# Altium schematic sheet Sheet1.SchDoc
size A2
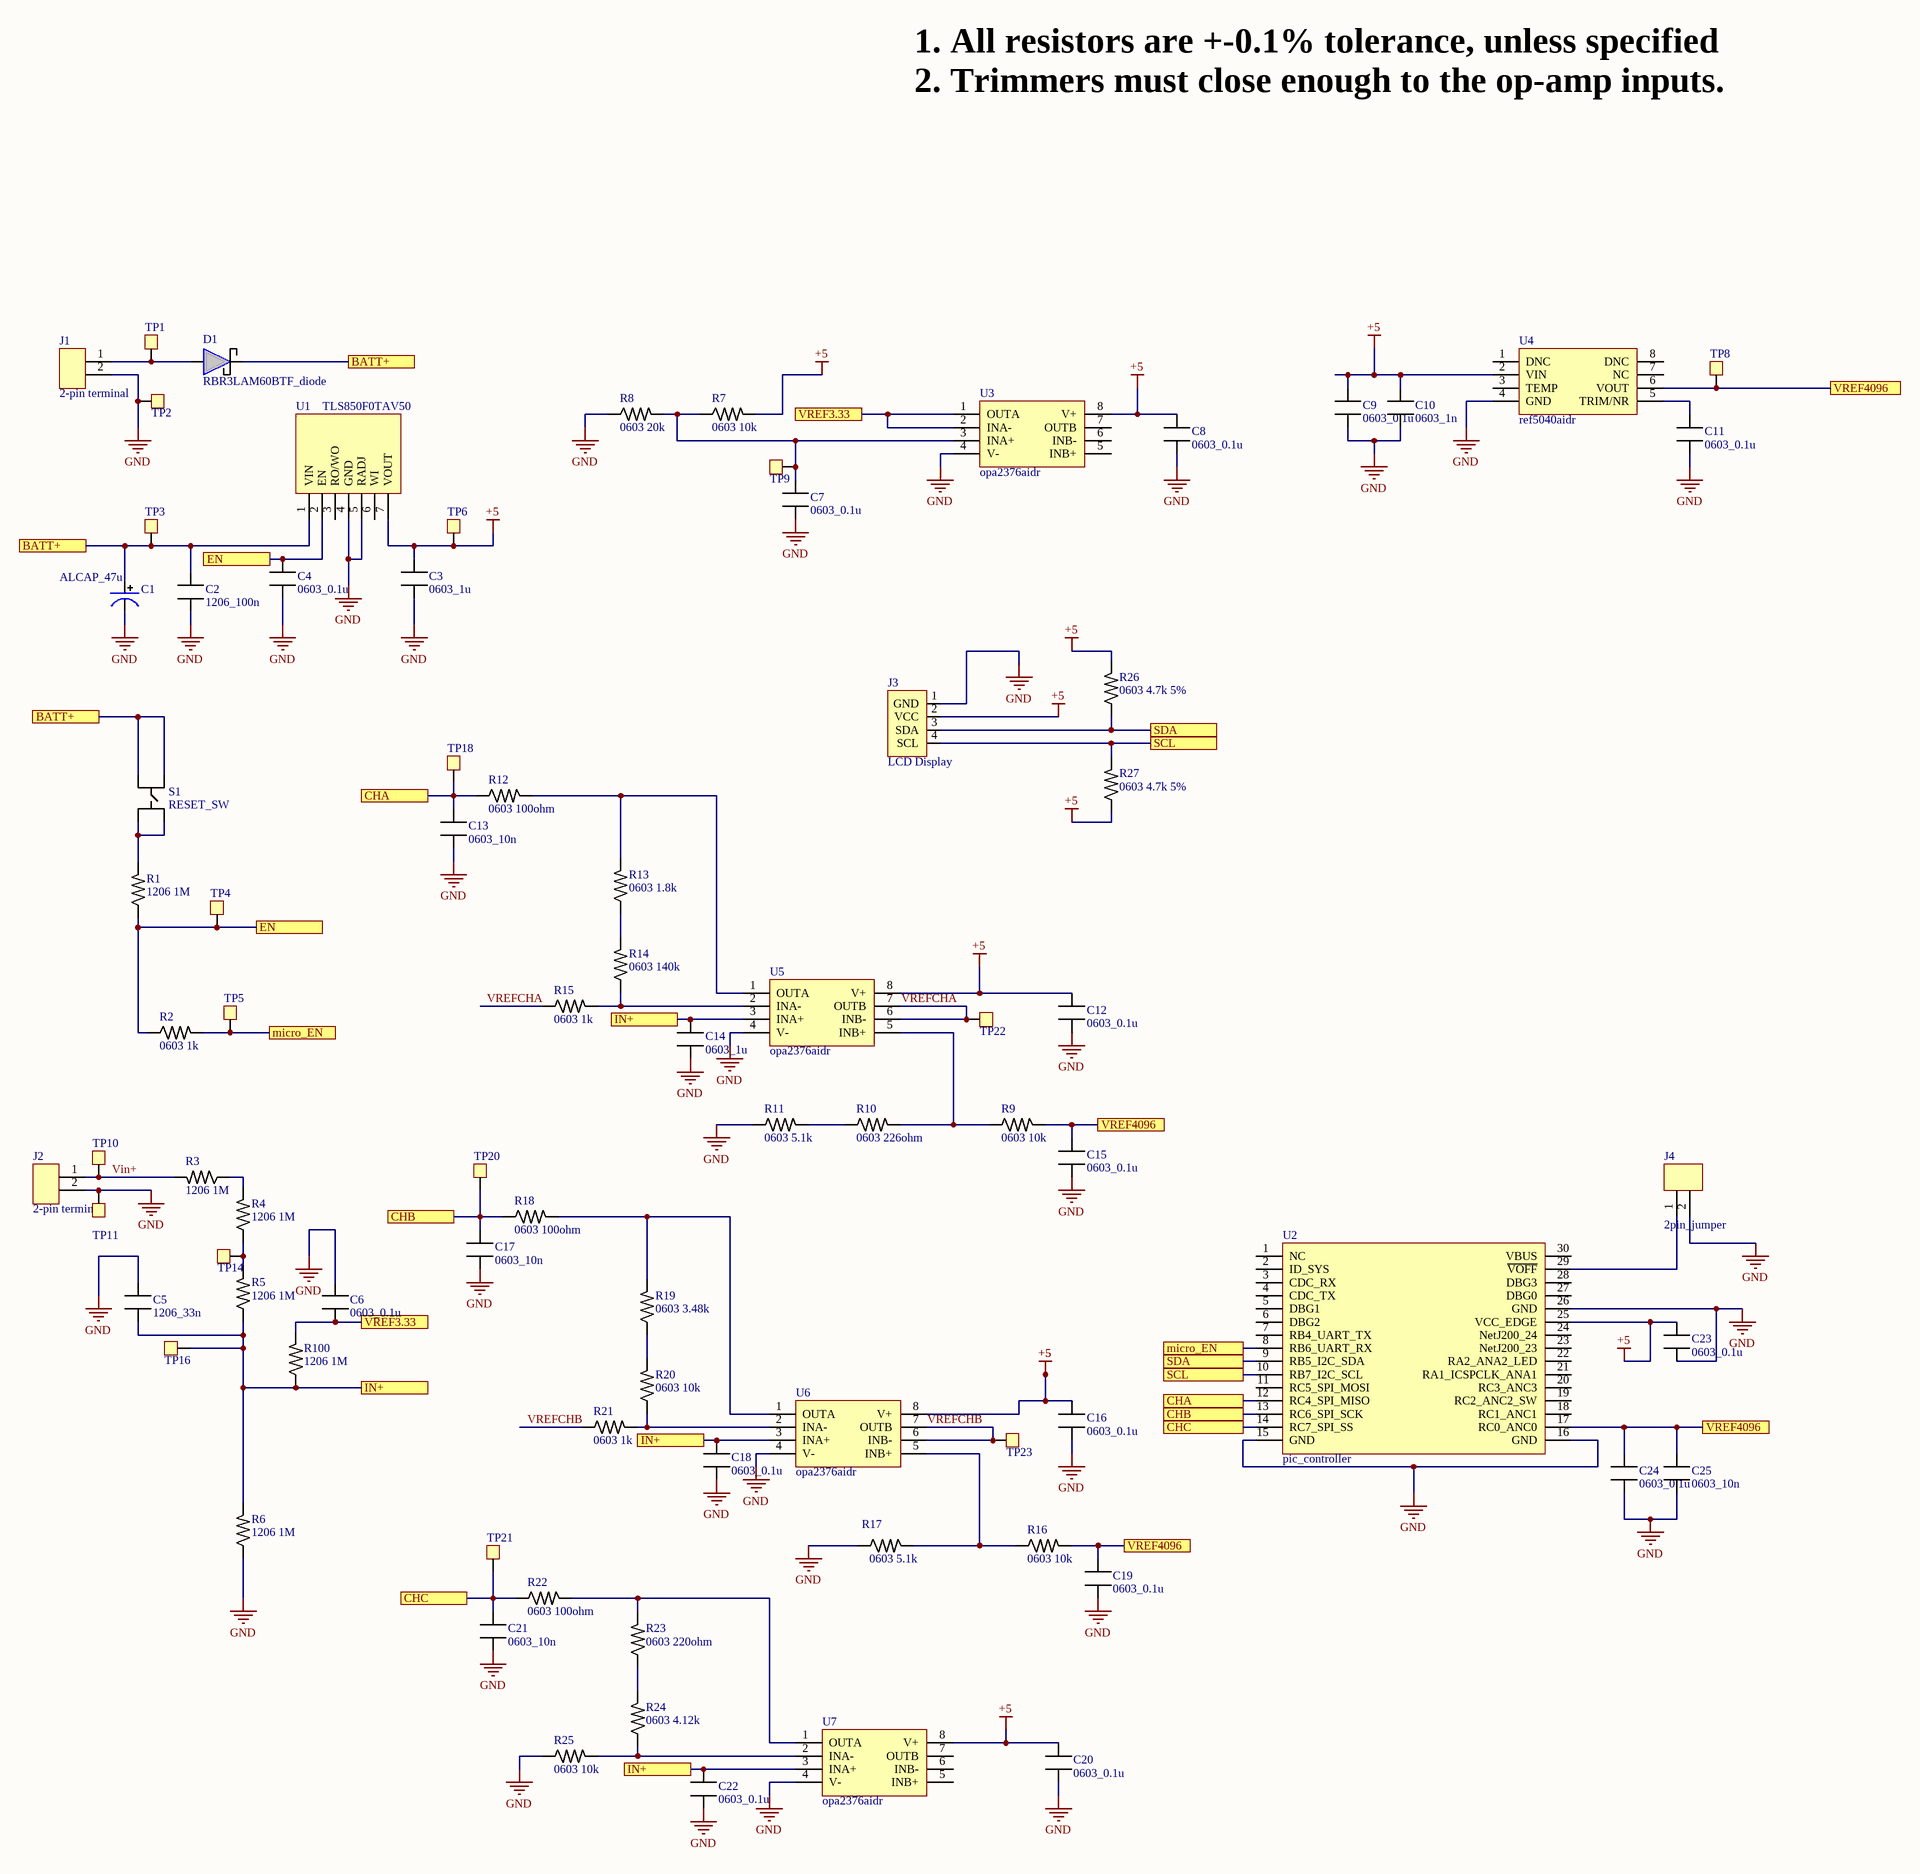
[diagram p0: Sheet1.SchDoc]

## Parts
C1  ALCAP_47u  [47u_cap]
C2  1206_100n  [CAPC3216X10M]
C3  0603_1u  [CAP_0603]
C4  0603_0.1u  [CAP_0603]
C5  1206_33n  [CAPC3216X10M]
C6  0603_0.1u  [CAP_0603]
C7  0603_0.1u  [CAP_0603]
C8  0603_0.1u  [CAP_0603]
C9  0603_0.1u  [CAP_0603]
C10  0603_1n  [CAP_0603]
C11  0603_0.1u  [CAP_0603]
C12  0603_0.1u  [CAP_0603]
C13  0603_10n  [CAP_0603]
C14  0603_1u  [CAP_0603]
C15  0603_0.1u  [CAP_0603]
C16  0603_0.1u  [CAP_0603]
C17  0603_10n  [CAP_0603]
C18  0603_0.1u  [CAP_0603]
C19  0603_0.1u  [CAP_0603]
C20  0603_0.1u  [CAP_0603]
C21  0603_10n  [CAP_0603]
C22  0603_0.1u  [CAP_0603]
C23  0603_0.1u  [CAP_0603]
C24  0603_0.1u  [CAP_0603]
C25  0603_10n  [CAP_0603]
D1  RBR3LAM60BTF_diode  [RBR3LAM60BTF_diode]
J1  2-pin terminal  [2-pin terminal]
J2  2-pin terminal  [2-pin terminal]
J3  LCD Display  [LCD Display]
J4  2pin_jumper  [2pin_jumper]
R1  1206 1M  [RESC3216X10M]
R2  0603 1k  [RES_0603]
R3  1206 1M  [RESC3216X10M]
R4  1206 1M  [RESC3216X10M]
R5  1206 1M  [RESC3216X10M]
R6  1206 1M  [RESC3216X10M]
R7  0603 10k  [RES_0603]
R8  0603 20k  [RES_0603]
R9  0603 10k  [RES_0603]
R10  0603 226ohm  [RES_0603]
R11  0603 5.1k  [RES_0603]
R12  0603 100ohm  [RES_0603]
R13  0603 1.8k  [RES_0603]
R14  0603 140k  [RES_0603]
R15  0603 1k  [RES_0603]
R16  0603 10k  [RES_0603]
R17  0603 5.1k  [RES_0603]
R18  0603 100ohm  [RES_0603]
R19  0603 3.48k  [RES_0603]
R20  0603 10k  [RES_0603]
R21  0603 1k  [RES_0603]
R22  0603 100ohm  [RES_0603]
R23  0603 220ohm  [RES_0603]
R24  0603 4.12k  [RES_0603]
R25  0603 10k  [RES_0603]
R26  0603 4.7k 5%  [RES_0603]
R27  0603 4.7k 5%  [RES_0603]
R100  1206 1M  [RESC3216X10M]
S1  RESET_SW  [RST_SW]
TP1  TP  [TP]  (value not drawn)
TP2  TP  [TP]  (value not drawn)
TP3  TP  [TP]  (value not drawn)
TP4  TP  [TP]  (value not drawn)
TP5  TP  [TP]  (value not drawn)
TP6  TP  [TP]  (value not drawn)
TP8  TP  [TP]  (value not drawn)
TP9  TP  [TP]  (value not drawn)
TP10  TP  [TP]  (value not drawn)
TP11  TP  [TP]  (value not drawn)
TP14  TP  [TP]  (value not drawn)
TP16  TP  [TP]  (value not drawn)
TP18  TP  [TP]  (value not drawn)
TP20  TP  [TP]  (value not drawn)
TP21  TP  [TP]  (value not drawn)
TP22  TP  [TP]  (value not drawn)
TP23  TP  [TP]  (value not drawn)
U1  TLS850F0TAV50  [TLS850F0TAV50]
U2  pic_controller  [nano]
U3  opa2376aidr  [opa2376aidr]
U4  ref5040aidr  [ref5040aidr]
U5  opa2376aidr  [opa2376aidr]
U6  opa2376aidr  [opa2376aidr]
U7  opa2376aidr  [opa2376aidr]

## Ports
BATT+, CHA, CHB, CHC, EN, IN+, micro_EN, SCL, SDA, VREF3.33, VREF4096

## Nets
+5: C3.2 C8.2 C9.2 C10.2 C12.2 C16.2 C20.2 C23.1 J3.2(VCC) R7.2 R26.2 R27.1 TP6.1 U1.7(VOUT) U2.25(VCC_EDGE) U3.8(V+) U4.2(VIN) U5.8(V+) U6.8(V+) U7.8(V+)
GND: C1.2 C2.1 C3.1 C4.1 C5.2 C6.2 C7.1 C8.1 C9.1 C10.1 C11.1 C12.1 C13.1 C14.1 C15.1 C16.1 C17.1 C18.1 C19.1 C20.1 C21.1 C22.1 C23.2 C24.2 C25.2 J1.2 J2.2 J3.1(GND) J4.2 R6.1 R8.1 R11.1 R17.1 R25.1 TP2.1 TP11.1 U1.4(GND) U1.5(RADJ) U2.15(GND) U2.16(GND) U2.26(GND) U3.4(V-) U4.4(GND) U5.4(V-) U6.4(V-) U7.4(V-)
BATT+: C1.1 C2.2 D1.1 S1.1 S1.2 TP3.1 U1.1(VIN) ; port BATT+
CHA: C13.2 R12.1 TP18.1 U2.12(RC4_SPI_MISO) ; port CHA
CHB: C17.2 R18.1 TP20.1 U2.13(RC6_SPI_SCK) ; port CHB
CHC: C21.2 R22.1 TP21.1 U2.14(RC7_SPI_SS) ; port CHC
EN: C4.2 R1.1 R2.1 TP4.1 U1.2(EN) ; port EN
IN+: C5.1 C14.2 C18.2 C22.2 R5.1 R6.2 R100.1 TP16.1 U5.3(INA+) U6.3(INA+) U7.3(INA+) ; port IN+
micro_EN: R2.2 TP5.1 U2.8(RB6_UART_RX) ; port micro_EN
SCL: J3.4(SCL) R27.2 U2.10(RB7_I2C_SCL) ; port SCL
SDA: J3.3(SDA) R26.1 U2.9(RB5_I2C_SDA) ; port SDA
Vin+: J2.1 R3.2 TP10.1
VREF3.33: C6.1 R100.2 U3.1(OUTA) U3.2(INA-) ; port VREF3.33
VREF4096: C15.2 C19.2 C24.1 C25.1 R9.2 R16.2 TP8.1 U2.17(RC0_ANC0) U4.6(VOUT) ; port VREF4096
VREFCHA: R15.1 TP22.1 U5.6(INB-) U5.7(OUTB)
VREFCHB: R21.1 TP23.1 U6.6(INB-) U6.7(OUTB)
NetC7_2: C7.2 R7.1 R8.2 TP9.1 U3.3(INA+)
NetC11_2: C11.2 U4.5(TRIM/NR)
NetD1_2: D1.2 J1.1 TP1.1
NetJ4_1: J4.1 U2.29(~{VOFF})
NetR1_2: R1.2 S1.3 S1.4
NetR3_1: R3.1 R4.2
NetR4_1: R4.1 R5.2 TP14.1
NetR9_1: R9.1 R10.2 U5.5(INB+)
NetR10_1: R10.1 R11.2
NetR12_2: R12.2 R13.2 U5.1(OUTA)
NetR13_1: R13.1 R14.2
NetR14_1: R14.1 R15.2 U5.2(INA-)
NetR16_1: R16.1 R17.2 U6.5(INB+)
NetR18_2: R18.2 R19.2 U6.1(OUTA)
NetR19_1: R19.1 R20.2
NetR20_1: R20.1 R21.2 U6.2(INA-)
NetR22_2: R22.2 R23.2 U7.1(OUTA)
NetR23_1: R23.1 R24.2
NetR24_1: R24.1 R25.2 U7.2(INA-)

Not connected (* = marked no-connect by the designer): U1 3(RO/WO) 6(WI); U2 1(NC) 2(ID_SYS) 3(CDC_RX) 4(CDC_TX) 5(DBG1) 6(DBG2) 7(RB4_UART_TX) 11(RC5_SPI_MOSI) 18(RC1_ANC1) 19(RC2_ANC2_SW) 20(RC3_ANC3) 21(RA1_ICSPCLK_ANA1) 22(RA2_ANA2_LED) 23(NetJ200_23) 24(NetJ200_24) 27(DBG0) 28(DBG3) 30(VBUS); U3 5(INB+) 6(INB-) 7(OUTB); U4 1(DNC) 3(TEMP) 7(NC) 8(DNC); U7 5(INB+) 6(INB-) 7(OUTB)

## Notes on the sheet
- 1. All resistors are +-0.1% tolerance, unless specified
  2. Trimmers must close enough to the op-amp inputs.

## Library data of the parts
C1 = ALCAP_47UF: ALCAP; ComponentLink1Description: EEUFR1J470; ComponentLink1URL: https://www.digikey.com/product-detail/en/panasonic-electronic-components/EEU-FR1J470/P15400-ND/3072280
C2 C5 = CAP_1206: ComponentLink1Description: C1206C104K5RAC7800; ComponentLink1URL: https://www.digikey.com/product-detail/en/kemet/C1206C104K5RAC7800/399-C1206C104K5RAC7800CT-ND/411524
C3 C4 C6-C25 = CAP_0603: ComponentLink1Description: C0603C105K4RACTU; ComponentLink1URL: https://www.digikey.com/product-detail/en/kemet/C0603C105K4RACTU/399-7847-1-ND/3471570
R1 R2 R7-R27 = RES_0603: RES_0603 1/8 W
  R13 R14 R19 R20 R23 R24: ComponentLink1Description: P162KDBCT-ND; ComponentLink1URL: https://www.digikey.com/product-detail/en/panasonic-electronic-components/ERA-8AEB302V/P3.0KBCCT-ND/3069729
R3-R6 R100 = RES_1206
  R3: ComponentLink1Description: P3.0KBCCT-ND; ComponentLink1URL: https://www.digikey.com/product-detail/en/panasonic-electronic-components/ERA-8AEB302V/P3.0KBCCT-ND/3069729
  R4: ComponentLink1Description: PAT900CCT-ND; ComponentLink1URL: https://www.digikey.com/product-detail/en/vishay-thin-film/PAT1206E9000BST1/PAT900CCT-ND/2279070
  R5: ComponentLink1Description: P90.9BCCT-ND; ComponentLink1URL: https://www.digikey.com/product-detail/en/panasonic-electronic-components/ERA-8AEB90R9V/P90.9BCCT-ND/3069989
  R6 R100: ComponentLink1Description: RT1206BRD0710RL; ComponentLink1URL: https://www.digikey.com/product-detail/en/yageo/RT1206BRD0710RL/YAG2330CT-ND/5252444
D1 = RBR3LAM60BTF_diode: ComponentLink1Description: RBR3LAM60BTF; ComponentLink1URL: https://www.digikey.com/product-detail/en/rohm-semiconductor/RBR3LAM60BTFTR/RBR3LAM60BTFCT-ND/8702638
S1 = RESET_SW: ComponentLink1Description: 450-1650-ND; ComponentLink1URL: https://www.digikey.com/product-detail/en/te-connectivity-alcoswitch-switches/1825910-6/450-1650-ND/1632536
U1 = TLS850F0TAV50: ComponentLink1Description: TLS850F0TAV50; ComponentLink1URL: https://www.digikey.com/product-detail/en/infineon-technologies/TLS850F0TAV50ATMA1/TLS850F0TAV50ATMA1CT-ND/5824338
U3 U5-U7 = opa2376aidr: ComponentLink1Description: opa2376aidr; ComponentLink1URL: https://www.digikey.com/product-detail/en/texas-instruments/OPA2376AIDR/296-22564-1-ND/1669056
U4 = ref5040aidr: ComponentLink1Description: ref5040aidr; ComponentLink1URL: https://www.digikey.com/product-detail/en/texas-instruments/REF5040AIDR/296-46190-1-ND/7033365